# EAGLE design SoundLab (EAGLE 7.6.0)
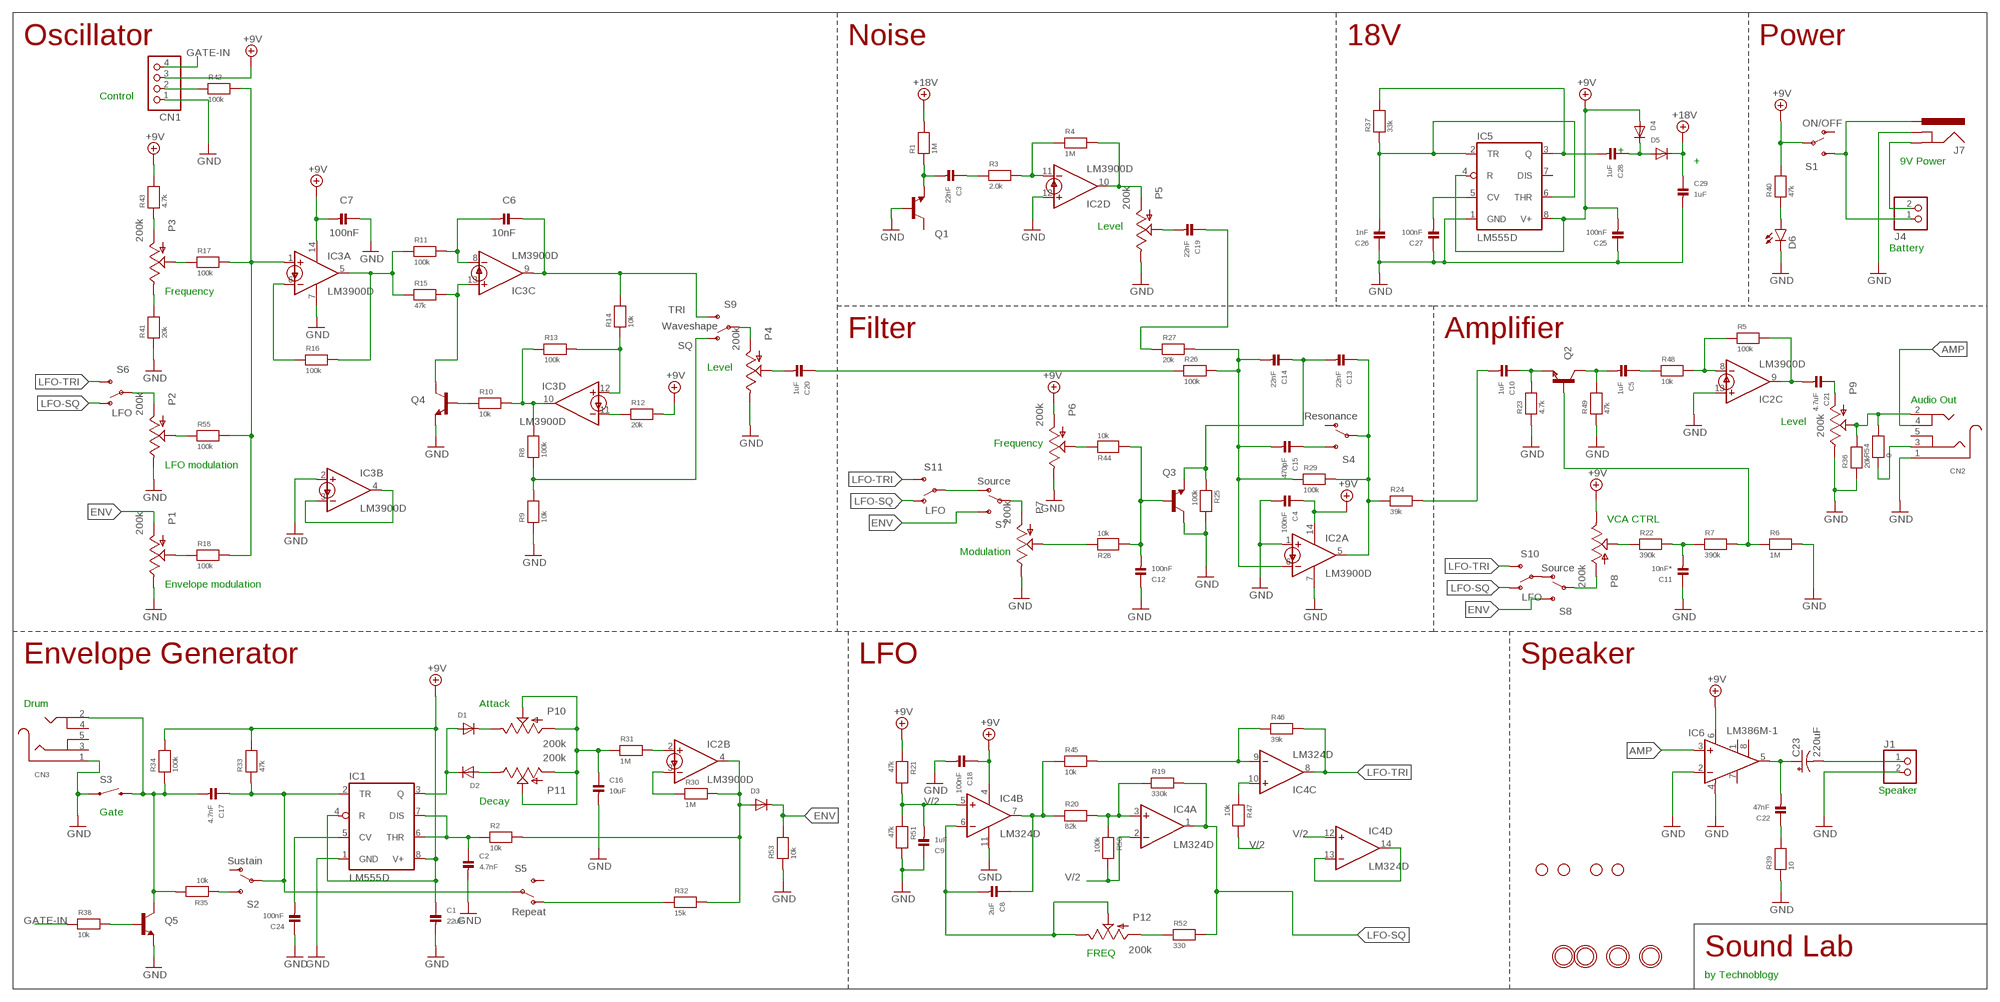
[diagram p0: schematic, sheet 1]

## Parts
C1  22uF  CAP_CERAMIC_0805MP  [_0805MP]
C2  4.7nF  CAP_CERAMIC_0805MP  [_0805MP]
C3  22nF  CAP_CERAMIC_0805MP  [_0805MP]
C4  100nF  CAP_CERAMIC_0805MP  [_0805MP]
C5  1uF  CAP_CERAMIC_0805MP  [_0805MP]
C6  10nF  CAP_CERAMIC_0805MP  [_0805MP]
C7  100nF  CAP_CERAMIC_0805MP  [_0805MP]
C8  2uF  CAP_CERAMIC_0805MP  [_0805MP]
C9  1uF  CAP_CERAMIC_0805MP  [_0805MP]
C10  1uF  CAP_CERAMIC_0805MP  [_0805MP]
C11  10nF*  CAP_CERAMIC_0805MP  [_0805MP]
C12  100nF  CAP_CERAMIC_0805MP  [_0805MP]
C13  22nF  CAP_CERAMIC_0805MP  [_0805MP]
C14  22nF  CAP_CERAMIC_0805MP  [_0805MP]
C15  470pF  CAP_CERAMIC_0805MP  [_0805MP]
C16  10uF  CAP_CERAMIC_0805MP  [_0805MP]
C17  4.7nF  CAP_CERAMIC_0805MP  [_0805MP]
C18  100nF  CAP_CERAMIC_0805MP  [_0805MP]
C19  22nF  CAP_CERAMIC_0805MP  [_0805MP]
C20  1uF  CAP_CERAMIC_0805MP  [_0805MP]
C21  4.7uF  CAP_CERAMIC_0805MP  [_0805MP]
C22  47nF  CAP_CERAMIC_0805MP  [_0805MP]
C23  220uF  47UF-50V-20%(ELECT)  [PANASONIC_D]
C24  100nF  CAP_CERAMIC_0805MP  [_0805MP]
C25  100nF  CAP_CERAMIC_0805MP  [_0805MP]
C26  1nF  CAP_CERAMIC_0805MP  [_0805MP]
C27  100nF  CAP_CERAMIC_0805MP  [_0805MP]
C28  1uF  CAP_CERAMIC_0805MP  [_0805MP]
C29  1uF  CAP_CERAMIC_0805MP  [_0805MP]
CN1  JST_4PIN  [JSTPH4]
CN2  AUDIO_3.5MMJACK  [4UCONN_19269]
CN3  AUDIO_3.5MMJACK  [4UCONN_19269]
D1  DIODESOD-123  [SOD-123]
D2  DIODESOD-123  [SOD-123]
D3  DIODESOD-123  [SOD-123]
D4  DIODESOD-123  [SOD-123]
D5  DIODESOD-123  [SOD-123]
D6  LED1206-BOTTOM  [LED-1206-BOTTOM]
IC1  LM555D  [SO08]
IC2  LM3900D  [SO14]
IC3  LM3900D  [SO14]
IC4  LM324D  [SO14]
IC5  LM555D  [SO08]
IC6  LM386M-1  [SO08]
J1  HEADER-1X2EDGE  [1X02_EDGESMT]
J4  HEADER-1X2EDGE  [1X02_EDGESMT]
J7  5.5x2.1mm Barrel  POWER_JACKSMD  [POWER_JACK_SMD]
JP1  STAND-OFF  [STAND-OFF]
JP2  STAND-OFF  [STAND-OFF]
JP3  STAND-OFF  [STAND-OFF]
JP4  STAND-OFF  [STAND-OFF]
P1  200k  POT  [ALPS_POT]
P2  200k  POT  [ALPS_POT]
P3  200k  POT  [ALPS_POT]
P4  200k  POT  [ALPS_POT]
P5  200k  POT  [ALPS_POT]
P6  200k  POT  [ALPS_POT]
P7  200k  POT  [ALPS_POT]
P8  200k  POT  [ALPS_POT]
P9  200k  POT  [ALPS_POT]
P10  200k  POT  [ALPS_POT]
P11  200k  POT  [ALPS_POT]
P12  200k  POT  [ALPS_POT]
Q1  MMBT3904  TRANSISTOR_NPNMMBT2222A  [SOT23-3]
Q2  MMBT3904  TRANSISTOR_NPNMMBT2222A  [SOT23-3]
Q3  MMBT3904  TRANSISTOR_NPNMMBT2222A  [SOT23-3]
Q4  MMBT3904  TRANSISTOR_NPNMMBT2222A  [SOT23-3]
Q5  MMBT3904  TRANSISTOR_NPNMMBT2222A  [SOT23-3]
R1  1M  RESISTOR_0805MP  [_0805MP]
R2  10k  RESISTOR_0805MP  [_0805MP]
R3  2.0k  RESISTOR_0805MP  [_0805MP]
R4  1M  RESISTOR_0805MP  [_0805MP]
R5  100k  RESISTOR_0805MP  [_0805MP]
R6  1M  RESISTOR_0805MP  [_0805MP]
R7  390k  RESISTOR_0805MP  [_0805MP]
R8  100k  RESISTOR_0805MP  [_0805MP]
R9  10k  RESISTOR_0805MP  [_0805MP]
R10  10k  RESISTOR_0805MP  [_0805MP]
R11  100k  RESISTOR_0805MP  [_0805MP]
R12  20k  RESISTOR_0805MP  [_0805MP]
R13  100k  RESISTOR_0805MP  [_0805MP]
R14  10k  RESISTOR_0805MP  [_0805MP]
R15  47k  RESISTOR_0805MP  [_0805MP]
R16  100k  RESISTOR_0805MP  [_0805MP]
R17  100k  RESISTOR_0805MP  [_0805MP]
R18  100k  RESISTOR_0805MP  [_0805MP]
R19  330k  RESISTOR_0805MP  [_0805MP]
R20  82k  RESISTOR_0805MP  [_0805MP]
R21  47k  RESISTOR_0805MP  [_0805MP]
R22  390k  RESISTOR_0805MP  [_0805MP]
R23  4.7k  RESISTOR_0805MP  [_0805MP]
R24  39k  RESISTOR_0805MP  [_0805MP]
R25  100k  RESISTOR_0805MP  [_0805MP]
R26  100k  RESISTOR_0805MP  [_0805MP]
R27  20k  RESISTOR_0805MP  [_0805MP]
R28  10k  RESISTOR_0805MP  [_0805MP]
R29  100k  RESISTOR_0805MP  [_0805MP]
R30  1M  RESISTOR_0805MP  [_0805MP]
R31  1M  RESISTOR_0805MP  [_0805MP]
R32  15k  RESISTOR_0805MP  [_0805MP]
R33  47k  RESISTOR_0805MP  [_0805MP]
R34  100k  RESISTOR_0805MP  [_0805MP]
R35  10k  RESISTOR_0805MP  [_0805MP]
R36  20k  RESISTOR_0805MP  [_0805MP]
R37  33k  RESISTOR_0805MP  [_0805MP]
R38  10k  RESISTOR_0805MP  [_0805MP]
R39  10  RESISTOR_0805MP  [_0805MP]
R40  47k  RESISTOR_0805MP  [_0805MP]
R41  20k  RESISTOR_0805MP  [_0805MP]
R42  100k  RESISTOR_0805MP  [_0805MP]
R43  4.7k  RESISTOR_0805MP  [_0805MP]
R44  10k  RESISTOR_0805MP  [_0805MP]
R45  10k  RESISTOR_0805MP  [_0805MP]
R46  39k  RESISTOR_0805MP  [_0805MP]
R47  10k  RESISTOR_0805MP  [_0805MP]
R48  10k  RESISTOR_0805MP  [_0805MP]
R49  47k  RESISTOR_0805MP  [_0805MP]
R50  100k  RESISTOR_0805MP  [_0805MP]
R51  47k  RESISTOR_0805MP  [_0805MP]
R52  330  RESISTOR_0805MP  [_0805MP]
R53  10k  RESISTOR_0805MP  [_0805MP]
R54  0  RESISTOR_0805MP  [_0805MP]
R55  100k  RESISTOR_0805MP  [_0805MP]
S1  ON/OFF  SWITCH-SPDTPTH  [SWITCH-SPDT]
S2  Sustain  SWITCH-SPDTPTH  [SWITCH-SPDT]
S3  SWITCH-MOMENTARY-212MM  [TACTILE-PTH-12MM]
S4  Resonance  SWITCH-SPDTPTH  [SWITCH-SPDT]
S5  Repeat  SWITCH-SPDTPTH  [SWITCH-SPDT]
S6  LFO  SWITCH-SPDTPTH  [SWITCH-SPDT]
S7  Source  SWITCH-SPDTPTH  [SWITCH-SPDT]
S8  Source  SWITCH-SPDTPTH  [SWITCH-SPDT]
S9  Waveshape  SWITCH-SPDTPTH  [SWITCH-SPDT]
S10  LFO  SWITCH-SPDTPTH  [SWITCH-SPDT]
S11  LFO  SWITCH-SPDTPTH  [SWITCH-SPDT]
U$2  MOUNTINGHOLE2.0  [MOUNTINGHOLE_2.0_PLATED]
U$3  MOUNTINGHOLE2.0  [MOUNTINGHOLE_2.0_PLATED]
U$6  MOUNTINGHOLE2.0  [MOUNTINGHOLE_2.0_PLATED]
U$7  MOUNTINGHOLE2.0  [MOUNTINGHOLE_2.0_PLATED]

## Nets
+9V: C1.1 C4.1 C7.2 C18.1 C25.2 CN1.3 D4.A IC1.4(R) IC1.8(V+) IC2.14(P:V+) IC3.14(P:V+) IC4.4(P:V+) IC5.4(R) IC5.8(V+) IC6.6(VS) P6.P$3(A) P8.P$1(E) R12.2 R21.1 R33.2 R34.2 R40.2 R43.2 S1.2(P)
+18V: C29.1 D5.C R1.2
AMP: CN2.4 IC6.3(+IN)
ENV: D3.C P1.P$3(A) R53.2 S7.3(S) S8.3(S)
ENV2: D3.A IC2.4(B:OUT) R2.2 R30.2 R32.2
GATE-IN: CN1.4 R38.1
GND: C1.2 C2.2 C4.2 C7.1 C9.1 C11.1 C12.1 C16.2 C18.2 C24.1 C25.1 C26.1 C27.1 C29.2 CN1.1 CN2.1 CN3.1 D6.C IC1.1(GND) IC2.1(A:+IN) IC2.7(P:GND) IC2.12(D:+IN) IC2.13(C:+IN) IC3.2(B:+IN) IC3.7(P:GND) IC4.11(P:V-) IC5.1(GND) IC6.2(-IN) IC6.4(GND) J1.2 J7.GND(GNDBREAK) P1.P$1(E) P2.P$1(E) P4.P$1(E) P5.P$1(E) P6.P$1(E) P7.P$1(E) P9.P$1(E) Q1.1(B) Q3.3(C) Q4.2(E) Q5.2(E) R6.2 R9.1 R23.1 R25.2 R36.1 R39.1 R41.1 R49.1 R51.2 R53.1 S3.1
LFO->VCA: S8.1(O) S10.2(P)
LFO->VCF: S7.1(O) S11.2(P)
LFO->VCO: P2.P$3(A) S6.2(P)
LFO-SQ: IC4.1(A:OUT) R19.2 R52.2 S6.1(O) S10.1(O) S11.1(O)
LFO-TRI: IC4.8(C:OUT) R46.2 S6.3(S) S10.3(S) S11.3(S)
N$1: IC3.1(A:+IN) R17.2 R18.2 R42.2 R55.2
N$2: IC3.6(A:-IN) R16.1
N$3: IC3.5(A:OUT) R11.1 R15.1 R16.2
N$4: IC3.13(C:+IN) Q4.3(C) R15.2
N$5: C6.2 IC3.8(C:-IN) R11.2
N$6: C8.1 IC4.7(B:OUT) R20.1 R45.1
N$7: Q4.1(B) R10.1
N$8: IC3.10(D:OUT) R8.2 R10.2 R13.1
N$9: R32.1 S5.1(O)
N$10: C17.1 IC1.2(TR) R33.1 S2.2(P) S5.2(P)
N$11: C19.1 R27.1
N$12: C21.2 IC2.9(C:OUT) R5.2
N$13: C2.1 IC1.6(THR) IC1.7(DIS) R2.1
N$14: P2.P$2(S) R55.1
N$15: IC4.3(A:+IN) R19.1 R20.2 R50.1
N$16: P7.P$2(S) R28.1
N$17: Q5.1(B) R38.2
N$18: CN2.3 R54.1
N$19: C16.1 P10.P$2(S) P10.P$3(A) P11.P$2(S) P11.P$3(A) R31.1
N$20: CN1.2 R42.1
N$21: D2.A P11.P$1(E)
N$22: D1.A D2.C IC1.3(Q)
N$23: P6.P$2(S) R44.1
N$24: IC3.11(D:-IN) R12.1
N$25: C10.2 R24.2
N$26: C5.2 Q2.3(C) R49.2
N$27: P3.P$3(A) R43.1
N$28: C10.1 Q2.2(E) R23.2
N$29: P3.P$1(E) R41.2
N$30: P3.P$2(S) R17.1
N$31: P1.P$2(S) R18.1
N$32: IC2.8(C:-IN) R5.1 R48.2
N$33: IC3.12(D:+IN) R13.2 R14.1
N$34: C8.2 IC4.6(B:-IN) P12.P$1(E) P12.P$2(S)
N$35: R35.1 S2.3(S)
N$36: C5.1 R48.1
N$37: IC4.13(D:-IN) IC4.14(D:OUT)
N$39: C23.- J1.1
N$41: P12.P$3(A) R52.1
N$42: IC2.2(B:+IN) R31.2
N$43: CN2.2 P9.P$2(S) R36.2 R54.2
N$44: IC4.9(C:-IN) R45.2 R46.1
N$45: J4.2 J7.P$4(GND)
N$46: P8.P$2(S) R22.1
N$47: IC4.10(C:+IN) R47.1
N$48: C3.1 R3.1
N$50: IC2.11(D:-IN) R3.2 R4.1
N$51: IC2.10(D:OUT) P5.P$3(A) R4.2
N$52: C3.2 Q1.2(E) R1.1
N$53: C20.2 P4.P$2(S)
N$54: C21.1 P9.P$3(A)
N$55: C19.2 P5.P$2(S)
N$57: C13.2 C14.1 Q3.2(E) R25.1
N$58: D1.C P10.P$1(E)
N$59: P7.P$3(A) S7.2(P)
N$60: C13.1 IC2.5(A:OUT) R24.1 R29.2 S4.2(P)
N$61: D6.A R40.1
N$64: C12.2 Q3.1(B) R28.2 R44.2
N$65: C15.1 S4.3(S)
N$66: C22.2 C23.+ IC6.5(OUT)
N$67: P8.P$3(A) S8.2(P)
N$68: C17.2 CN3.2 Q5.3(C) R34.1 R35.2 S3.3
N$69: C11.2 R7.1 R22.2
N$70: Q2.1(B) R6.1 R7.2
N$71: IC3.3(B:-IN) IC3.4(B:OUT)
N$72: C28.2 IC5.3(Q) R37.2
N$73: C26.2 IC5.2(TR) IC5.6(THR) R37.1
N$74: IC2.3(B:-IN) R30.1
N$75: C27.2 IC5.5(CV)
N$76: C28.1 D4.C D5.A
N$77: C24.2 IC1.5(CV)
N$78: C22.1 R39.2
N$79: J4.1 J7.VIN0(PWR) S1.3(S)
NOISE: C14.2 C15.2 IC2.6(A:-IN) R26.2 R27.2 R29.1
SQ: R8.1 R9.2 S9.1(O)
TRI: C6.1 IC3.9(C:OUT) R14.2 S9.3(S)
V/2: C9.2 IC4.2(A:-IN) IC4.5(B:+IN) IC4.12(D:+IN) R21.2 R47.2 R50.2 R51.1
WAVE: P4.P$3(A) S9.2(P)
WAVEFORM: C20.1 R26.1
Unconnected: CN2.5 CN3.3 CN3.4 CN3.5 IC5.7(DIS) IC6.1(GAIN) IC6.7(BYPASS) IC6.8(GAIN) Q1.3(C) S1.1(O) S2.1(O) S4.1(O) S5.3(S)

## Notes on the sheet
- Oscillator | Noise | 18V | Power
- Control
- +
- + | 9V Power
- Level
- Battery
- Frequency
- Filter | Amplifier
- Level
- Audio Out
- Level
- Frequency
- LFO modulation
- VCA CTRL
- Modulation
- Envelope modulation
- Envelope Generator | LFO | Speaker
- Drum | Attack
- Speaker
- Decay
- Gate
- FREQ | Sound Lab
- by Technoblogy

## Library data of the parts
C1-C22 C24-C29 = microbuilder:CAP_CERAMIC: Ceramic Capacitors 0402 - 0402 Surface Mount Capacitors 16pF 50V 5% [Digikey: 445-4899-2-ND] 18pF 50V 5% [Digikey: 490-1281-2-ND] 22pF 50V 5% [Digikey: 490-1283-2-ND] 68pF 50V 5% [Digikey: 490-1289-2-ND] 0.1uF 10V 10% [Digikey: 490-1318-2-ND] 1.0uF 6.3V 10% [Digikey: 490-1320-2-ND] 0603 - 0603 Surface Mount Capacitors 16 pF 50V 5% [Digikey: 445-5051-2-ND] 22 pF 50V [Digikey: PCC220ACVTR-ND] 33 pF 50V 5% [Digikey: 490-1415-1-ND] 56pF 50V 5% [Digikey: 490-1421-1-ND] 220pF 50V 5% [Digikey: 445-1285-1-ND] 680 pF 50V 2200 pF 50V 5% C0G [Digikey: 445-1297-1-ND] 5600 pF 100V 5% X7R [Digikey: 478-3711-1-ND] 0.1 µF 25V 10% [Digikey: PCC2277TR-ND] 0.22 µF 16V 10% X7R [Digikey: 445-1318-1-ND] 1.0 µF 25V 10% [Digikey: 445-5146-2-ND] 0603 - RF Specific 3pF 250V +/-0.1pF RF [Digikey: 712-1347-1-ND] 18 pF 250V 5% [Digikey: 478-3505-1-ND or 712-1322-1-ND] 56 pF 250V 5% C0G RF [Digikey: 490-4867-1-ND] 68 pF 250V RF [Digikey: 490-4868-1-ND] 0805 - 0805 Surface Mount Capacitors 220 pF 250V 2% RF Ceramic Capacitor [Digikey: 712-1398-1-ND] 1000 pF 50V 2% NP0 Ceramic Capacitor [Digikey: 478-3760-1-ND] 0.1 µF 25V 10% Ceramic Capacitor [Digikey: PCC1828TR-ND] 1.0 µF 16V 10% Ceramic Capacitor[Digikey: 490-1691-2-ND] 10.0 µF 10V 10% Ceramic Capacitor[Digikey: 709-1228-1-ND] 10.0 uF 16V 10% Ceramic Capacitor [Digikey: 478-5165-2-ND] 47 uF 6.3V 20% Ceramic Capacitor [Digikey: 587-1779-1-ND or 399-5506-1-ND] 1206 - 1206 Surface Mount Capacitors 47uF 10V 20% Ceramic Capacitor [Digikey: 490-5528-1-ND or 399-5508-1-ND or 445-6010-1-ND] 100uF 6.3V -20%, +80% Y5V Ceramic Capacitor (Digikey: 490-4512-1-ND, Mouser: 81-GRM31CF50J107ZE1L)
C23 = SparkFun-Capacitors:47UF-50V-20%(ELECT): CAP-10547; PROD_ID: CAP-10547
CN1 = microbuilder:JST_4PIN: JST 4-Pin Right-Angle Connector 4UConnector: 17312
CN2 CN3 = microbuilder:AUDIO_3.5MMJACK: 3.5MM Audio Jack These are normally connected as follows, from left-to right on the schematic symbol above: Tip: Left Audio Inner Ring: Right Audio Shell: Common/GND
D1-D5 = adafruit:DIODE: Diode SMADIODE - SMA Surface Mount Package 20V 1A Schottky Diode Digikey: 641-1014-6-ND DO-1N4148 - Through Hole Small Current Diode SOD-123 20V 1 A (.5mV Vf) Schottky Diode - Digikey: MBRX120TPMSCT-ND SOD-323 10V 570mA (.38mV Vf, 3ns) Schottky Diode - Digikey: ZLLS410CT-ND SOD-523 30V 30mA Schottky Diode (RB751S-40TE61) - Digikey: RB751S-40TE61CT-ND SOT23-R/W - SOT23 Package (R = Solder Paste/Reflow Ovens, W = Hand-Soldering) BAT54Film 40V 300mA - Digikey: 497-7162-1-ND
D6 = SparkFun-LED:LED: LEDs Standard schematic elements and footprints for 5mm, 3mm, 1206, and 0603 sized LEDs. 5mm - Spark Fun Electronics SKU : COM-00529 (and others)
IC1 IC5 = adafruit:*555: TIMER Changed DIP package to have round (not oval) pin pads http://www.ladyada.net/library/pcb/eaglelibrary.html
IC2 IC3 = linear:LM3900: OP AMP
IC4 = linear:LM324: OP AMP
IC6 = linear:LM386?-*: Low Voltage Audio Power Amplifier Source: http://cache.national.com/ds/LM/LM386.pdf
J1 J4 = microbuilder:HEADER-1X2: PIN HEADER
J7 = SparkFun-Connectors:POWER_JACK: Power Jack This is the standard 5.5mm barrel jack for power. The PTH is the most common, proven, reliable, footprint. The Slot footprint only works if the mill layer is transmitted to the PCB fab house so be warned. Mating wall wart : TOL-00298 (and others); PROD_ID: CONN-08106; SF_ID: PRT-12748
JP1-JP4 = SparkFun:STAND-OFF: Stand Off This is the mechanical footprint for a #4 phillips button head screw. Use the keepout ring to avoid running the screw head into surrounding components. SKU : PRT-00447
P1-P12 = SparkFun-Electromechanical:POT; PROD_ID: RES-09177
Q1-Q5 = technoblogy:TRANSISTOR_NPN: Generic NPN BJT MMBT2222A - TRANS-08049 (SOT-23, 1A 40V) MPSA42 - TRANS-09116 (SOT-23, 500mA 300V) MMBT5088LT1G - TRANS-11160 (SOT-23, 50 mA 30V) BC547 - COM-08928 <http://www.sparkfun.com/products/8928> (TO-92 45V 100mA) (1.Collector 2.Base 3.Emitter) 2N3904 - COM-00521 <http://www.sparkfun.com/products/521> (TO-92 40V 200mA) (1.Emitter 2.Base 3.Collector) P2N2222A - COM-12852 <http://www.sparkfun.com/products/12852> (TO-92 40V 600mA) (1.Collector 2.Base 3.Emitter); PROD_ID: TRANS-08049; VALUE: MMBT2222A
R1-R55 = microbuilder:RESISTOR: Resistors 0402 - 0402 Surface Mount Package 22 Ohm 1% 1/16W [Digikey: 311-22.0LRTR-ND] 33 Ohm 5% 1/16W 1.0K 5% 1/16W 1.5K 5% 1/16W 2.0K 1% 1/16W 10.0K 1% 1/16W [Digikey: 311-10.0KLRTR-ND] 10.0K 5% 1/16W [Digikey: RMCF0402JT10K0TR-ND] 12.1K 1% 1/16W [Digikey: 311-22.0LRTR-ND] 100.0K 5% 1/16W 0603 - 0603 Surface Mount Package 0 Ohm 1/10 Watt 1% Resistor 15 Ohm 1/10 Watt 1% Resistor 33 Ohm 1/10 Watt 1% Resistor 49.9 Ohm 1/10 Watt 1% Resistor 100 Ohm 1/10 Watt 1% Resistor 150 Ohm 1/10 Watt 1% Resistor 240 Ohm 1/10 Watt 1% Resistor 390 Ohm 1/10 Watt 1% Resistor 560 Ohm 1/10 Watt 1% Resistor 680 Ohm 1/10 Watt 1% Resistor 750 Ohm 1/10 Watt 1% Resistor 1.0K Ohm 1/10 Watt 1% Resistor 1.5K Ohm 1/10 Watt 1% Resistor 2.0K Ohm 1/10 Watt 1% Resistor 2.2K Ohm 1/10 Watt 1% Resistor 3.3K Ohm 1/10 Watt 1% Resistor 4.7K Ohm 1/10 Watt 1% Resistor 10.0K Ohm 1/10 Watt 1% Resistor 12.0K Ohm 1/10 Watt 1% Resistor 12.1K Ohm 1/10 Watt 1% Resistor 20.0K Ohm 1/10 Watt 1% Resistor 33.0K Ohm 1/10 Watt 1% Resistor 100.0K Ohm 1/10 Watt 1% Resistor 0805 - 0805 Surface Mount Package 0 Ohm 1/8 Watt 1% Resistor 33 Ohm 1/8 Watt 1% Resistor 100 Ohm 1/8 Watt 1% Resistor 150 Ohm 1/8 Watt 1% Resistor 200 Ohm 1/8 Watt 1% Resistor 240 Ohm 1/8 Watt 1% Resistor 330 Ohm 1/8 Watt 1% Resistor 390 Ohm 1/8 Watt 1% Resistor 470 Ohm 1/8 Watt 1% Resistor 1.0K Ohm 1/8 Watt 1% Resistor 1.5K Ohm 1/8 Watt 1% Resistor 2.0K Ohm 1/8 Watt 1% Resistor 4.7K Ohm 1/8 Watt 1% Resistor 5.1K Ohm 1/8 Watt 1% Resistor 5.6K Ohm 1/8 Watt 1% Resistor 10.0K Ohm 1/8 Watt 1% Resistor 22.0K Ohm 1/8 Watt 1% Resistor 33.0K Ohm 1/8 Watt 1% Resistor 100K Ohm 1/8 Watt 1% Resistor 1206 - 1206 Surface Mount Package 2012 - 2010 Surface Mount Package 0.11 Ohm 1/2 Watt 1% Resistor - Digikey: RHM.11UCT-ND
S1 S2 S4-S11 = technoblogy:SWITCH-SPDT: SPDT Switch Simple slide switch, Spark Fun Electronics SKU : COM-00102 DPDT SMT slide switch, AYZ0202, SWCH-08179; PROD_ID: SWCH-08261
S3 = SparkFun-Electromechanical:SWITCH-MOMENTARY-2: Various NO switches- pushbuttons, reed, etc; PROD_ID: SWCH-09185
U$2 U$3 U$6 U$7 = microbuilder:MOUNTINGHOLE: Mounting Hole For #2 screws (0.086"/2.18mm width, 0.094"/2.4mm hole) use 2.5mm

## Board
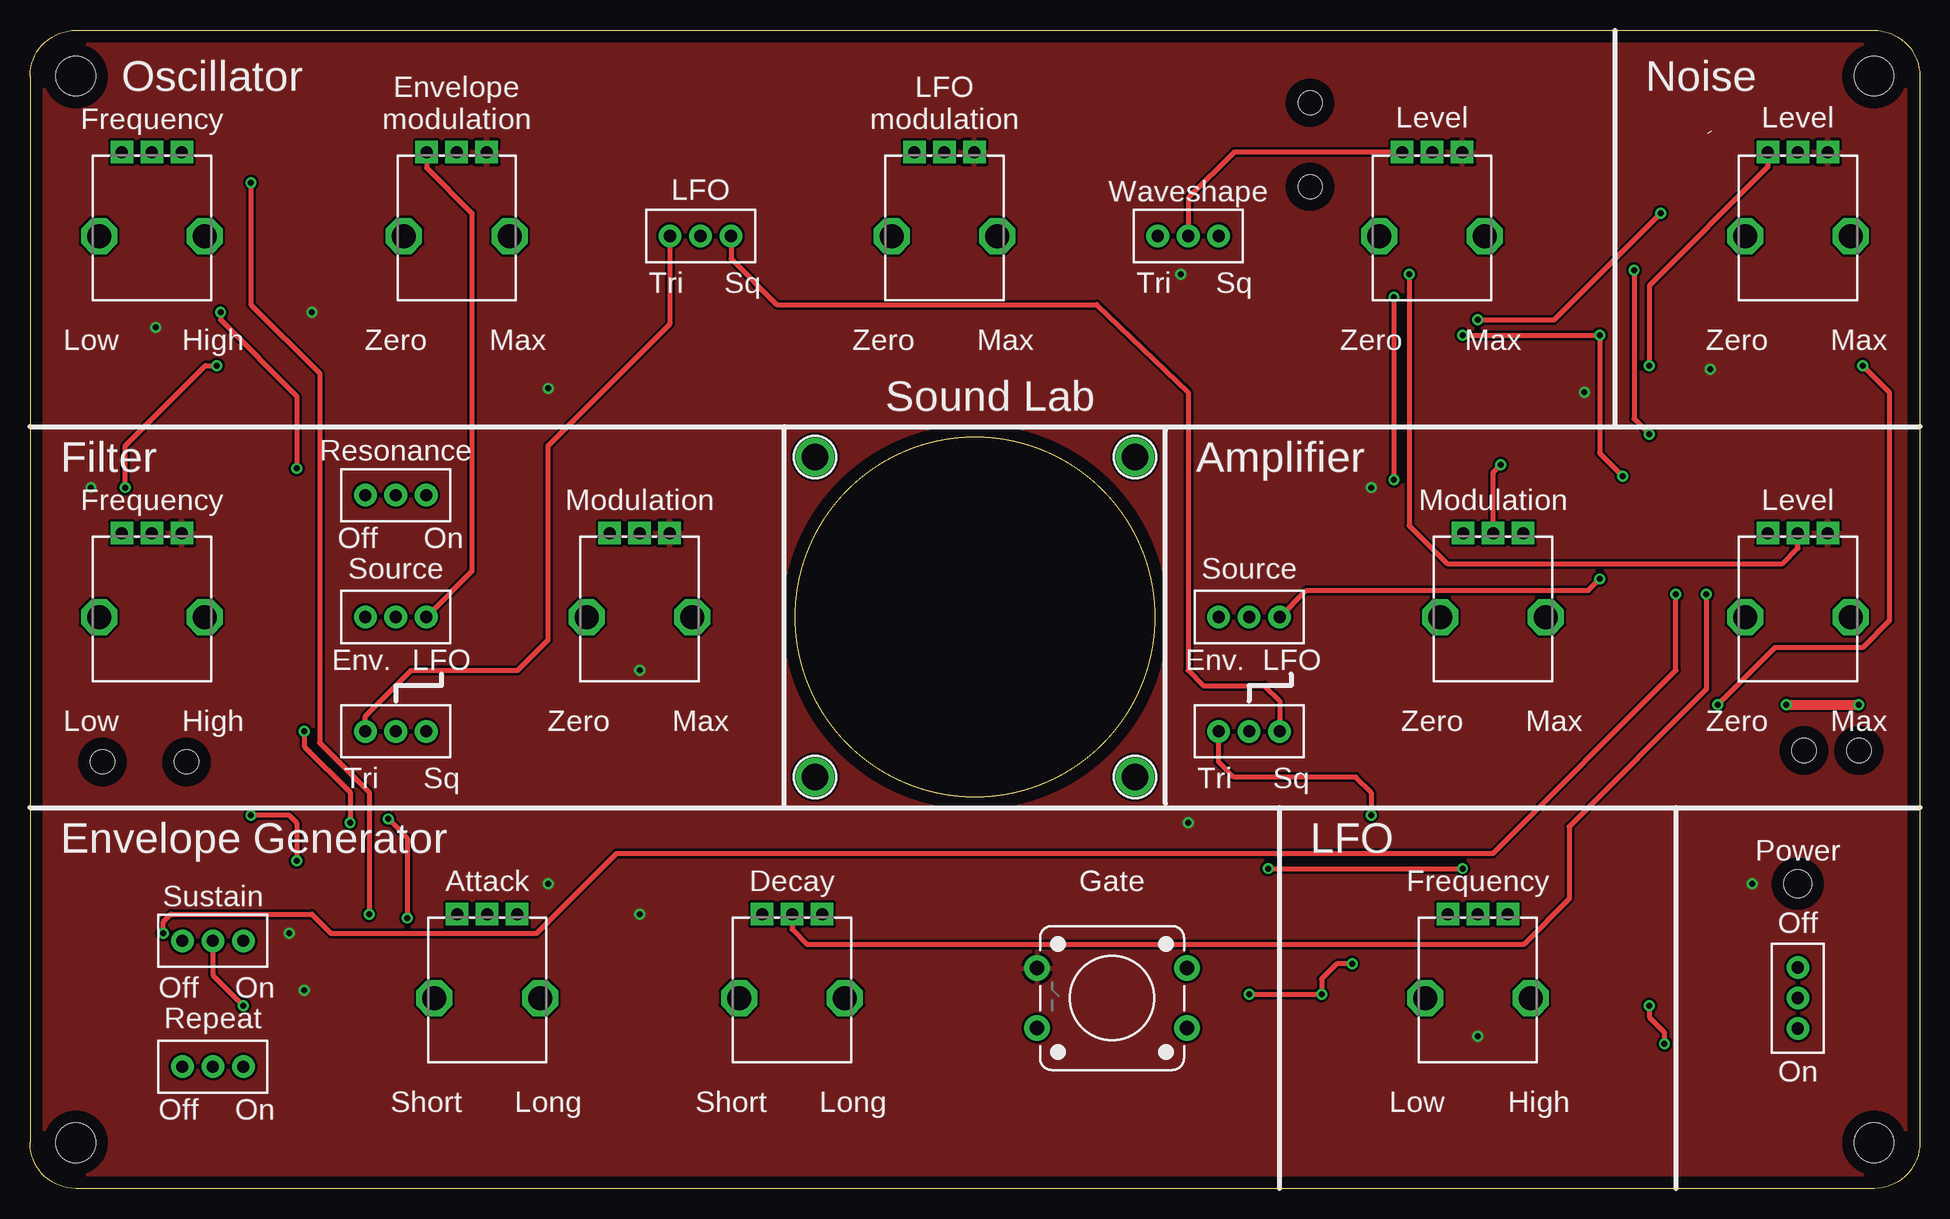
[diagram p1: board, top side]
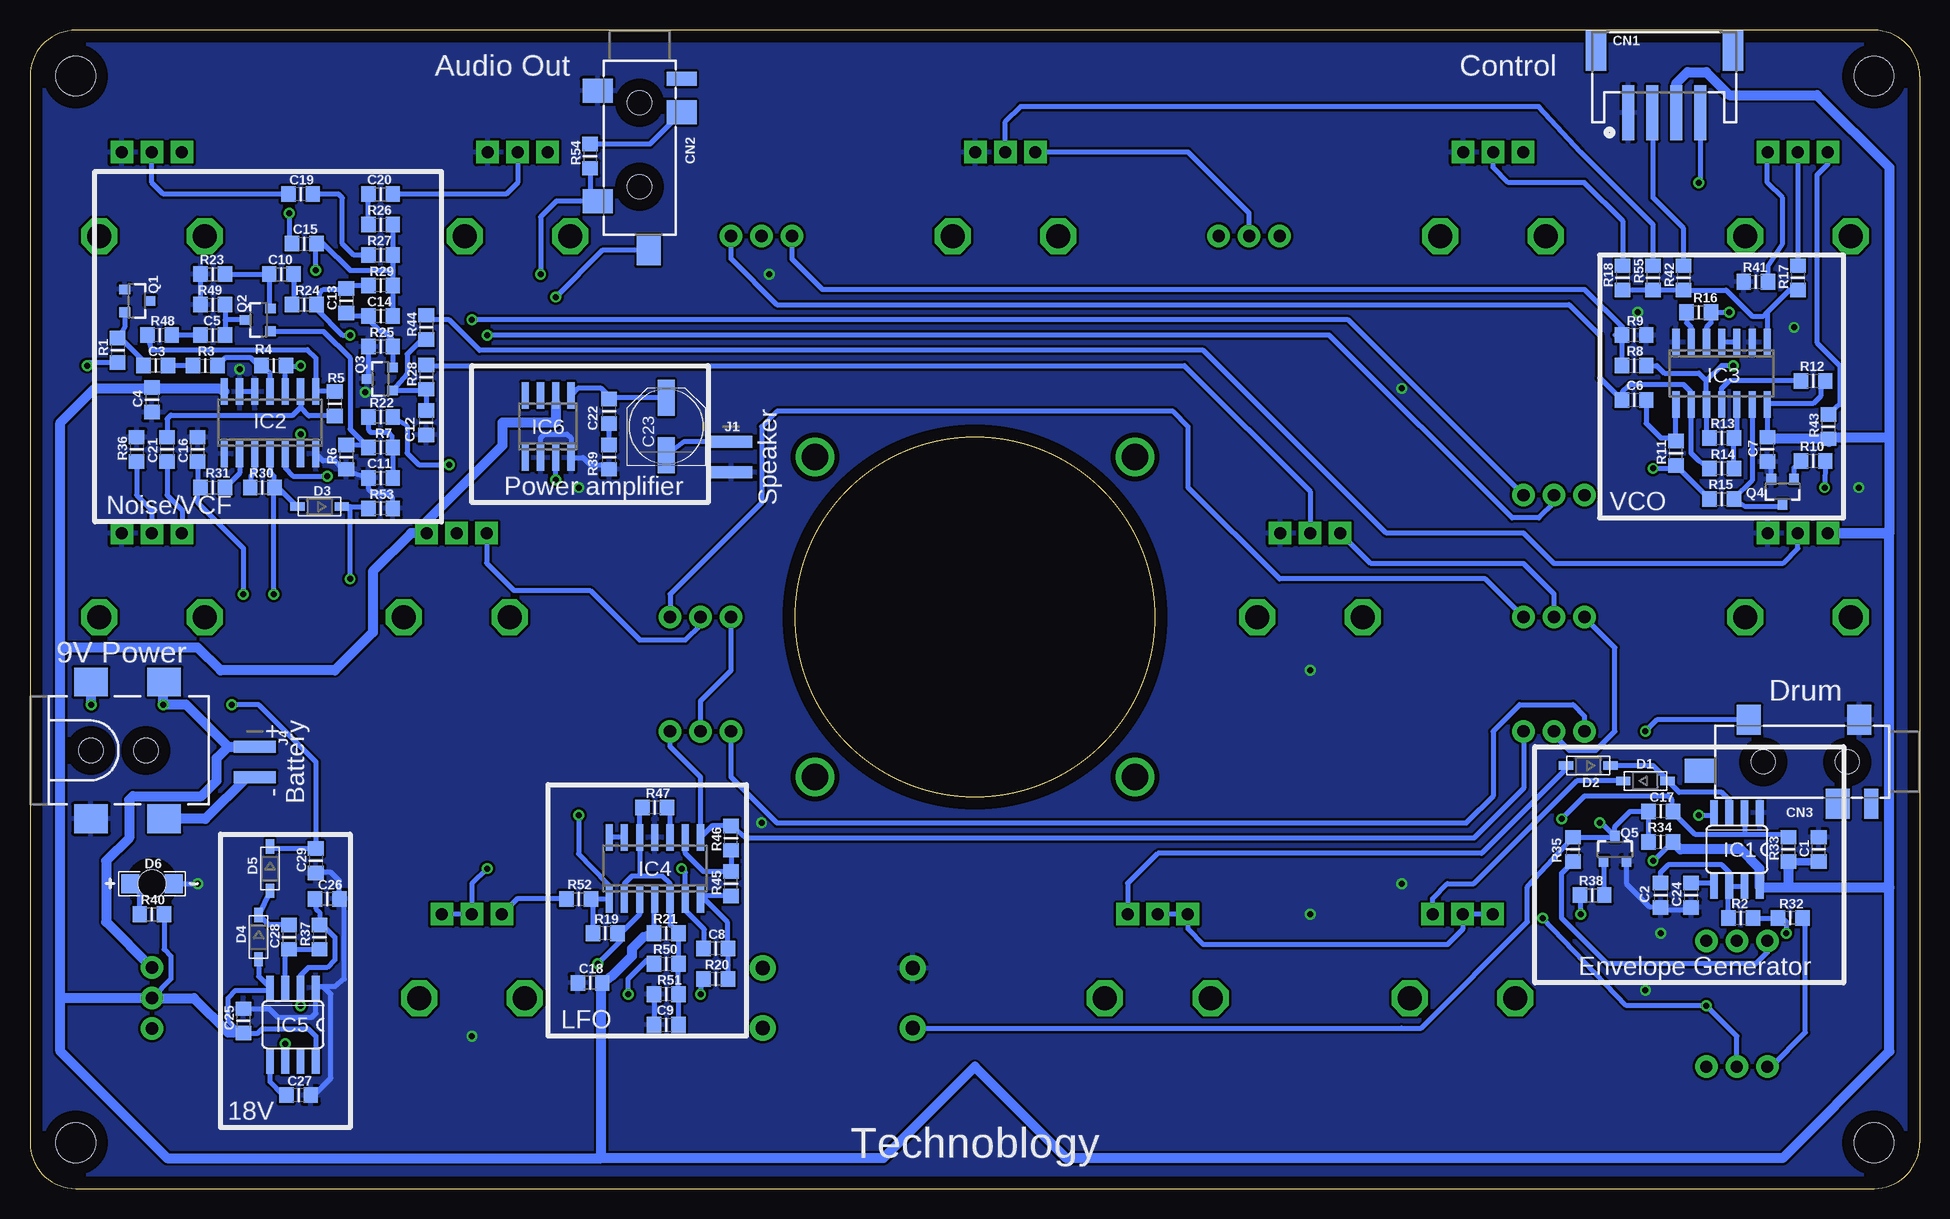
[diagram p2: board, bottom side, seen from below]

Size 157.48 x 96.52 mm. Coordinates in mm from the lower left corner, seen from the top.
Outline: 0,92.71 arc-90 3.81,96.52 153.67,96.52 arc-90 157.48,92.71 157.48,3.81 arc-90 153.67,0 3.81,0 arc-90 0,3.81 0,92.71
Outline: circle at 78.74,47.62 radius 14.99
Copper layers (1*16): Top 0.035mm / dielectric 1.5mm / Bottom 0.035mm
Design rules "default *": minimum track width 10mil, minimum drill 24mil, track to track 8mil, track to pad 8mil, pad to pad 8mil, via to via 8mil, smd to smd 8mil, copper to edge 40mil, drill to drill 8mil, minimum pad ring 10mil, minimum via ring 8mil, stop-mask expansion 4mil, vias tented up to drill 20mil, thermal gap 10mil

### Footprints (pad centres in the part's own frame; a part is rotated, then mirrored left to right if it is on the bottom)
_0805MP = smd 1.2 x 1.3: 1 -1.016,0; 2 1.016,0
PANASONIC_D = smd 3 x 1.4: + 2.4,0; - -2.4,0
JSTPH4 = smd 1 x 4.6: 1 -3,-3.7; 2 -1,-3.7; 3 1,-3.7; 4 3,-3.7 | smd 1.7 x 3.4: NC1 -5.7,1.5; NC2 5.7,1.5
4UCONN_19269 = smd 2 x 2.5: 1 2.5,-3.5; 2 11.7,-3.5; 3 4.3,3.5 | smd 2.5 x 2: 4 15.8,0.75 | smd 1.2 x 2.5: 5 1.5,3.5 | hole 2: 3.5,0; 10.5,0
SOD-123 = smd 1.2 x 0.7: A 1.85,0; C -1.85,0
LED-1206-BOTTOM = smd 1.5 x 1.6: A -1.8,0; C 1.8,0 | hole 2.3: 0,0
SO08 = smd 0.66 x 2.032: 1 -1.905,-3.073; 2 -0.635,-3.073; 3 0.635,-3.073; 4 1.905,-3.073; 5 1.905,3.073; 6 0.635,3.073; 7 -0.635,3.073; 8 -1.905,3.073
SO14 = smd 0.6 x 2.2: 1 -3.81,-2.6; 2 -2.54,-2.6; 3 -1.27,-2.6; 4 0,-2.6; 5 1.27,-2.6; 6 2.54,-2.6; 7 3.81,-2.6; 8 3.81,2.6; 9 2.54,2.6; 10 1.27,2.6; 11 0,2.6; 12 -1.27,2.6; 13 -2.54,2.6; 14 -3.81,2.6
SO08' = smd 0.6 x 2.2: 1 -1.905,-2.6; 2 -0.635,-2.6; 3 0.635,-2.6; 4 1.905,-2.6; 5 1.905,2.6; 6 0.635,2.6; 7 -0.635,2.6; 8 -1.905,2.6
1X02_EDGESMT = smd 1 x 3.5: 1 -1.27,0; 2 1.27,0
POWER_JACK_SMD = smd 2.8 x 2.4: GND 0,-5.7; P$4 6.1,-5.7; VIN0 0,5.7; VIN1 6.1,5.7 | hole 2.032: 0,0; 4.572,0
STAND-OFF = hole 3.302: 0,0
ALPS_POT = drill 1 pad 1.88 square: P$1 7,-2.5; P$2 7,0; P$3 7,2.5 | drill 2 octagon: P$4 0,-4.4; P$5 0,4.4
SOT23-3 = smd 0.8 x 0.9: 1 -0.95,-1; 2 0.95,-1; 3 0,1.1
SWITCH-SPDT = drill 1.016 pad 1.88: 1 0,2.54; 2 0,0; 3 0,-2.54
TACTILE-PTH-12MM = drill 1.2 pad 2.159: 1 6.25,-2.5; 2 -6.25,-2.5; 3 6.25,2.5; 4 -6.25,2.5
MOUNTINGHOLE_2.0_PLATED = drill 2.2 pad 3: P$1 0,0

### Placement (x,y rotation side)
C1  8.41,28.26 90 bottom
C2  21.59,24.45 270 bottom
C3  147,68.58 180 bottom
C4  147.32,65.72 270 bottom
C5  142.24,71.12 0 bottom
C6  23.81,65.72 0 bottom
C7  12.7,61.59 90 bottom
C8  100.33,20 180 bottom
C9  104.46,13.65 0 bottom
C10  136.53,76.2 0 bottom
C11  128.27,59.21 0 bottom
C12  124.46,63.82 90 bottom
C13  131.13,73.98 270 bottom
C14  128.27,72.71 0 bottom
C15  134.62,78.74 0 bottom
C16  143.51,61.59 90 bottom
C17  21.59,31.43 180 bottom
C18  110.81,17.14 180 bottom
C19  134.94,82.87 180 bottom
C20  128.27,82.87 0 bottom
C21  146.05,61.59 90 bottom
C22  109.22,64.77 90 bottom
C23  104.46,63.5 90 bottom
C24  19.05,24.45 90 bottom
C25  139.7,13.97 270 bottom
C26  132.72,24.13 180 bottom
C27  135.1,7.78 180 bottom
C28  135.89,20.95 270 bottom
C29  133.67,27.3 270 bottom
CN1  21.27,93.34 0 bottom
CN2  106.68,93.98 270 bottom
CN3  2.54,35.56 180 bottom
D1  22.86,33.97 0 bottom
D2  27.62,35.24 180 bottom
D3  133.35,56.83 180 bottom
D4  138.43,20.95 270 bottom
D5  137.48,26.67 270 bottom
D6  147.32,25.4 0 bottom
IC1  15.24,28.26 180 bottom
IC2  137.48,63.82 0 bottom
IC3  16.51,67.94 180 bottom
IC4  105.41,26.67 0 bottom
IC5  135.57,13.65 180 bottom
IC6  LM386M-1  [SO08']  114.3,63.5 0 bottom
J1  99.06,60.96 270 bottom
J4  138.75,35.56 270 bottom
J7  152.4,36.51 0 bottom
JP1  3.81,92.71 0 top
JP2  153.67,92.71 0 top
JP3  3.81,3.81 0 top
JP4  153.67,3.81 0 top
P1  35.56,79.38 90 top
P2  76.2,79.38 90 top
P3  10.16,79.38 90 top
P4  116.84,79.38 90 top
P5  147.32,79.38 90 top
P6  10.16,47.62 90 top
P7  50.8,47.62 90 top
P8  121.92,47.62 90 top
P9  147.32,47.62 90 top
P10  38.1,15.88 90 top
P11  63.5,15.88 90 top
P12  120.65,15.88 90 top
Q1  148.59,73.98 270 bottom
Q2  138.43,72.39 90 bottom
Q3  128.27,67.47 90 bottom
Q4  11.43,58.1 180 bottom
Q5  25.4,28.26 0 bottom
R1  150.18,69.85 270 bottom
R2  14.92,22.54 0 bottom
R3  142.88,68.58 0 bottom
R4  137.16,68.58 0 bottom
R5  132.08,65.41 270 bottom
R6  131.13,60.96 270 bottom
R7  128.27,61.75 180 bottom
R8  23.81,68.58 0 bottom
R9  23.81,71.12 180 bottom
R10  8.89,60.64 0 bottom
R11  20.32,61.28 90 bottom
R12  8.89,67.31 0 bottom
R13  16.51,62.55 0 bottom
R14  16.51,60.01 180 bottom
R15  16.51,57.47 0 bottom
R16  18.41,73.03 0 bottom
R17  10.16,75.88 270 bottom
R18  24.77,75.88 270 bottom
R19  109.54,21.27 180 bottom
R20  100.33,17.46 180 bottom
R21  104.46,21.27 0 bottom
R22  128.27,64.29 180 bottom
R23  142.24,76.2 0 bottom
R24  134.62,73.66 180 bottom
R25  128.27,70.17 180 bottom
R26  128.27,80.33 0 bottom
R27  128.27,77.79 0 bottom
R28  124.46,67.63 270 bottom
R29  128.27,75.25 180 bottom
R30  138.11,58.42 0 bottom
R31  142.24,58.42 0 bottom
R32  10.79,22.54 180 bottom
R33  10.95,28.26 270 bottom
R34  21.59,28.89 0 bottom
R35  28.89,28.26 90 bottom
R36  148.59,61.59 270 bottom
R37  133.35,20.95 270 bottom
R38  27.3,24.45 0 bottom
R39  109.22,60.96 90 bottom
R40  147.32,22.86 0 bottom
R41  13.65,75.56 0 bottom
R42  19.68,75.88 270 bottom
R43  7.62,63.5 270 bottom
R44  124.46,71.75 270 bottom
R45  99.06,25.4 90 bottom
R46  99.06,29.21 90 bottom
R47  105.41,31.75 180 bottom
R48  146.69,71.12 180 bottom
R49  142.24,73.66 0 bottom
R50  104.46,18.73 0 bottom
R51  104.46,16.19 180 bottom
R52  111.76,24.13 0 bottom
R53  128.27,56.67 180 bottom
R54  110.81,86.04 270 bottom
R55  22.23,75.88 270 bottom
S1  147.32,15.88 180 top
S2  15.24,20.64 270 top
S3  90.17,15.88 180 top
S4  30.48,57.78 90 top
S5  15.24,10.16 90 top
S6  55.88,79.38 90 top
S7  30.48,47.62 90 top
S8  101.6,47.62 90 top
S9  96.52,79.38 90 top
S10  101.6,38.1 90 top
S11  30.48,38.1 90 top
U$2  65.41,60.96 0 top
U$3  92.08,60.96 0 top
U$6  65.41,34.29 0 top
U$7  92.08,34.29 0 top

### Tracks (layer width: path | path; a pad name or v marks a point on that pad's centre or on a via)
+9V  (via drill 0.5)
  Top 0.406: v22.23,27.3 22.23,30.48 21.59,31.11 v18.41,31.11
  Bottom 0.406: R12.2 8.26,66.93 8.26,66.04 8.89,65.41 12.64,65.41 IC3.14 C7.2 12.7,62.55 | R21.1 105.47,24.01 IC4.4 | IC5.8 133.67,12.7 134.3,13.34 138.11,13.34 138.49,12.95 C25.2 139.95,12.95 140.97,13.97 140.97,15.88 140.34,16.51 137.69,16.51 IC5.4 138.43,17.68 D4.A | v22.23,27.3 22.16,27.3 R34.2 | v18.41,31.11 17.25,31.11 IC1.4 | IC6.6 113.67,65.41 | 146.69,15.88 S1.2 145.73,17.46 145.73,19.37 146.3,19.94 R40.2
  Bottom 0.61: C1.1 R33.2
  Bottom 0.813: 139.7,13.16 C25.2 | 154.94,15.88 154.94,11.43 146.05,2.54 109.86,2.54 | 154.94,15.88 154.94,45.09 | 154.94,45.09 154.94,63.82 152.08,66.67 147.38,66.67 C4.1 147.26,66.67 141.54,66.67 IC2.14 | 109.86,2.54 109.86,17.08 C18.1 108.9,17.78 107.31,19.37 107.31,20 106.36,20.95 R21.1 | 7.56,62.23 R43.2 | 154.94,45.09 143.51,45.09 141.6,43.18 132.08,43.18 128.91,46.35 128.91,51.44 125.72,54.62 P8.P$1 124.46,54.66 124.46,55.56 118.11,61.91 118.11,63.82 113.67,63.82 113.67,65.41 | 2.54,54.61 2.56,54.62 P6.P$3 7.64,54.61 2.54,54.61 | 139.9,13.16 C25.2 | 2.54,25.08 2.54,11.43 11.43,2.54 71.12,2.54 78.74,10.16 86.36,2.54 109.86,2.54 | 2.54,25.08 2.54,54.61 | CN1.3 20.27,92.12 19.37,93.03 17.78,93.03 15.88,91.12 8.57,91.12 2.54,85.09 2.54,62.55 | 2.54,62.55 2.54,54.61 | 12.64,62.55 C7.2 12.7,62.48 R43.2 | 2.54,25.08 10.95,25.08 | 10.95,25.08 13.23,25.08 IC1.8 13.34,26.67 14.92,28.26 19.94,28.26 R34.2 | R33.2 10.95,25.08 | 2.54,62.55 7.62,62.55 R43.2 | 154.94,15.88 S1.2 143.83,15.88 140.97,13.02 139.76,13.02 C25.2
+18V  (via drill 0.5)
  Top 0.406: v152.72,68.58 154.94,66.36 154.94,47.31 152.72,45.09 145.41,45.09 v140.65,40.32
  Bottom 0.406: 133.78,28.2 C29.1 | C29.1 137.28,28.32 D5.C | R1.2 152.46,68.83 v152.72,68.58 | C29.1 133.67,35.56 138.43,40.32 v140.65,40.32
AMP  (via drill 0.5)
  Top 0.406: v113.67,74.3 v113.67,59.05
  Bottom 0.406: v113.67,59.05 IC6.3 | CN2.4 109.78,78.18 v113.67,74.3
ENV  (via drill 0.5)
  Top 0.406: S8.3 106.36,49.85 129.86,49.85 v130.81,50.8 | P1.P$3 33.06,85.05 36.83,81.28 36.83,51.44 S7.3
  Bottom 0.406: 130.81,56.83 D3.C | v130.81,50.8 130.81,56.83 | 130.81,56.83 129.44,56.83 R53.2 | S8.3 104.14,49.53 96.52,57.15 96.52,63.5 95.25,64.77 62.23,64.77 60.96,63.5 60.96,58.42 53.34,50.8 36.2,50.8 S7.3
ENV2  (via drill 0.5)
  Top 0.406: v137.16,49.53 137.16,43.18 121.92,27.94 48.9,27.94 42.23,21.27 25.08,21.27 23.5,22.86 11.75,22.86 11.11,22.23 v11.11,21.27
  Bottom 0.406: R2.2 R32.2 11.75,22.61 11.75,22.86 11.11,22.23 v11.11,21.27 | v137.16,49.53 137.16,58.36 R30.2 | IC2.4 137.48,59.69 137.16,59.37 137.16,58.48 R30.2 | R30.2 136.79,58.42 D3.A
GATE-IN  (via drill 0.5)
  Top 0.406: v28.26,22.86 28.26,33.02 24.13,37.15 24.13,67.94 18.41,73.66 v18.41,83.82
  Bottom 0.406: v28.26,22.86 28.26,24.38 R38.1 | CN1.4 18.27,83.96 v18.41,83.82
GND  (via drill 0.5)
  Bottom 0.406: R39.1 109.6,60.33 110.81,60.33 111.38,60.9 IC6.4 112.39,62.55 112.71,62.87 114.62,62.87 114.94,62.55 IC6.2 | IC2.12 IC2.13 | 12.64,60.58 C7.1 12.38,60.26 12.38,59.37 | C27.1 133.83,7.78 132.4,9.21 132.4,16.19 133.03,16.83 | 133.03,16.83 133.57,16.83 IC5.1 133.67,14.61 133.99,14.29 136.84,14.29 137.54,14.99 C25.1 | 133.03,16.83 132.08,16.83 131.29,17.46 131.29,23.88 C26.1 131.7,25.65 132.4,26.35 133.6,26.35 C29.2 | R51.2 C9.1 | 143.19,73.72 R49.1 | 143.51,73.91 R49.1 | R49.1 R23.1 | C24.1 19.17,23.55 19.17,23.29 19.05,23.18 21.34,23.18 C2.2 21.64,23.5 22.54,23.5 24.45,25.4 Q5.2 | IC2.7 133.09,60.64 132.08,60.64 131.38,59.94 R6.2 130.87,59.69 C11.1 129.29,58.33 128.91,57.94 127.64,57.94 127.25,57.56 R53.1 | R25.2 129.29,67.55 Q3.3 | D6.C v143.51,25.4
  other vias: 140.02,68.26 50.8,22.86 43.18,25.4 22.86,16.51 129.54,66.36 10.48,71.75 5.08,58.42 111.76,58.42 23.5,73.03 21.59,21.27 120.65,12.7 43.18,66.67 96.52,30.48 95.89,76.2 50.8,43.18
  pour Bottom: 0,96.52 157.48,96.52 157.48,0 0,0
  pour Top: 0,96.52 157.48,96.52 157.48,0 0,0
LFO->VCA
  Bottom 0.406: S10.2 101.6,40.64 99.06,43.18 S8.1
LFO->VCF
  Bottom 0.406: S11.2 30.48,37.78 29.21,36.51 26.99,36.51 25.4,38.1 25.4,45.09 S7.1
LFO->VCO
  Bottom 0.406: S6.2 55.88,81.28 60.96,86.36 73.69,86.36 P2.P$3
LFO-SQ  (via drill 0.5)
  Top 0.406: S11.1 27.94,39.37 31.75,43.18 40.64,43.18 43.18,45.72 43.18,61.91 53.34,72.07 S6.1 | v111.76,31.11 111.76,33.02 110.49,34.29 100.33,34.29 99.06,35.56 S10.1
  Bottom 0.406: R19.2 110.55,23.94 R52.2 109.28,24.13 IC4.1 109.28,25.34 111.78,27.92 111.76,27.94 v111.76,31.11 | S10.1 99.06,34.29 95.25,30.48 37.78,30.48 35.56,32.7 35.56,38.1 33.34,40.32 28.89,40.32 27.94,39.37 S11.1
LFO-TRI
  Top 0.406: S10.3 104.14,40.64 102.87,41.91 97.79,41.91 96.52,43.18 96.52,66.36 88.9,73.66 62.23,73.66 58.42,77.47 S6.3
  Bottom 0.406: S11.3 33.02,33.34 37.15,29.21 97.85,29.21 R46.2 100.64,30.23 IC4.8 101.6,34.29 104.14,36.83 S10.3
N$1
  Bottom 0.406: 12.64,70.48 IC3.1 12.7,73.03 | R18.2 R55.2 R42.2 16.13,74.87 13.97,72.71 13.02,72.71 12.7,73.03 | R17.2 10.86,74.87 12.7,73.03
N$2
  Bottom 0.406: R16.1 19.43,72.14 19.05,71.75 IC3.6
N$3  (via drill 0.5)
  Top 0.406: v15.88,73.03 15.88,72.39 22.23,66.04 v22.23,60.01
  Bottom 0.406: R15.1 R11.1 20.57,60.01 v22.23,60.01 | v15.88,73.03 R16.2 17.4,72.14 17.78,71.75 IC3.5
N$4
  Bottom 0.406: IC3.13 13.97,58.99 R15.2 14.54,56.83 11.75,56.83 Q4.3
N$5
  Bottom 0.406: IC3.8 R11.2 20.57,62.55 21.59,62.55 22.8,63.75 C6.2
N$6
  Bottom 0.406: 101.54,24.13 IC4.7 | R20.1 C8.1 99.38,20.07 99.38,22.23 101.22,24.07 IC4.7 | R45.1 101.29,24.38 IC4.7
N$7
  Bottom 0: R10.1 10.16,60.64 10.16,60.96
  Bottom 0.406: Q4.1 10.48,60.07 R10.1
N$8  (via drill 0.5)
  Top 0.406: v7.94,58.42 7.94,61.91 14.61,68.58 v15.56,68.58
  Bottom 0.406: R13.1 17.78,62.17 IC3.10 17.78,67.31 | R8.2 21.91,68.58 21.27,67.94 18.41,67.94 17.78,67.31 | 17.78,67.31 16.51,68.58 v15.56,68.58 | R10.2 v7.94,58.42
N$9
  Bottom 0.406: S5.1 12.38,10.16 9.53,13.02 9.53,22.29 R32.1
N$10  (via drill 0.5)
  Top 0.406: v29.84,30.8 31.43,29.21 v31.43,22.54 | v17.78,15.24 15.24,17.78 S2.2
  Bottom 0.406: 14.61,29.53 18.73,29.53 20.57,31.37 C17.1 20.64,31.5 20.64,32.38 20.95,32.7 27.94,32.7 v29.84,30.8 | 14.61,29.53 11.49,29.53 R33.1 | IC1.2 14.61,29.53 | v31.43,22.54 24.45,15.24 v17.78,15.24 15.24,12.7 S5.2
N$11
  Bottom 0.406: R27.1 130.49,77.79 131.44,78.74 131.44,82.55 131.76,82.87 C19.1
N$12
  Bottom 0.406: 134.94,65.09 135.57,64.45 145.73,64.45 146.05,64.14 C21.2 | R5.2 134.24,64.39 134.94,65.09 | IC2.9 134.94,65.09
N$13
  Bottom 0.406: IC1.6 15.88,26.35 16.51,26.99 20.95,26.99 21.59,26.35 C2.1 | IC1.6 IC1.7 | R2.1 15.94,25.12 IC1.6
N$14
  Bottom 0.406: R55.1 22.23,80.33 28.26,86.36 31.75,90.17 74.93,90.17 76.2,88.9 P2.P$2
N$15  (via drill 0.5)
  Top 0.406: v101.6,16.19 v107.63,16.19 107.63,17.46 108.9,18.73 v110.17,18.73
  Bottom 0.406: R20.2 101.6,17.46 v101.6,16.19 | IC4.3 106.68,22.86 108.27,21.27 | v107.63,16.19 107.63,17.46 106.05,19.05 R50.1 | 108.27,21.27 R19.1 | 108.27,21.27 108.27,20.64 v110.17,18.73
N$16
  Bottom 0.406: R28.1 124.46,68.58 61.28,68.58 50.8,58.1 P7.P$2
N$17
  Bottom 0.406: Q5.1 26.35,24.51 R38.2
N$18
  Bottom 0.406: R54.1 105.8,87.06 CN2.3
N$19  (via drill 0.5)
  Top 0.406: P11.P$2 63.5,21.59 64.77,20.32 124.46,20.32 128.27,24.13 128.27,30.16 139.7,41.59 v139.7,49.53
  Bottom 0.406: R31.1 143.26,58.17 | C16.1 143.51,58.67 R31.1 | R31.1 143.51,58.17 143.51,57.15 139.7,53.34 v139.7,49.53 | P10.P$3 P10.P$2 38.1,21.59 39.37,20.32 59.69,20.32 61,21.63 P11.P$3 P11.P$2
N$20
  Bottom 0.406: R42.1 19.68,80.01 22.23,82.55 22.23,89.6 CN1.2
N$21
  Bottom 0.406: P11.P$1 66,25.4 66.04,25.4 63.5,27.94 36.51,27.94 29.47,34.98 D2.A
N$22
  Bottom 0.406: IC1.3 15.88,32.38 16.51,33.02 20.06,33.02 D1.A 21.01,34.03 22.23,35.24 D2.C
N$23
  Bottom 0.406: R44.1 124.08,72.39 122.56,72.39 120.02,69.85 59.69,69.85 44.45,54.61 33.02,54.61 30.48,52.07 11.43,52.07 10.16,53.34 P6.P$2
N$24
  Bottom 0.406: R12.1 15.88,67.31 16.51,66.67 IC3.11
N$25
  Bottom 0.406: C10.2 135.51,73.79 R24.2
N$26
  Bottom 0.406: R49.2 141.22,72.39 | 141.22,72.39 C5.2 | Q2.3 141.22,72.39
N$27
  Bottom 0.406: P3.P$3 7.66,85.37 8.57,84.45 8.57,70.48 6.67,68.58 6.67,65.34 R43.1
N$28
  Bottom 0.406: R23.2 C10.1 137.54,73.45 Q2.2
N$29
  Bottom 0.406: R41.2 12.64,76.9 11.43,78.74 11.43,82.55 12.7,83.82 12.7,86.33 P3.P$1
N$30
  Bottom 0.406: P3.P$2 R17.1
N$31
  Bottom 0.406: R18.1 24.77,80.64 27.94,83.82 34.29,83.82 35.56,85.09 P1.P$2
N$32
  Bottom 0.406: R48.2 147.38,69.91 134.37,69.91 133.67,69.22 IC2.8 R5.1
N$33
  Bottom 0.406: IC3.12 15.24,62.17 R13.2 R14.1
N$34  (via drill 0.5)
  Top 0.406: v103.19,26.67 v119.38,26.67
  Bottom 0.406: C8.2 101.28,20.07 101.28,21.59 102.87,23.18 IC4.6 102.87,26.35 v103.19,26.67 | v119.38,26.67 120.65,25.4 P12.P$2 P12.P$1
N$35
  Bottom 0.406: R35.1 29.84,26.29 29.84,22.54 26.04,18.73 13.65,18.73 12.7,19.68 S2.3
N$36
  Bottom 0.406: C5.1 R48.1
N$37
  Bottom 0.406: IC4.13 IC4.14
N$39
  Bottom 0.406: J1.1 103.01,62.23 C23.-
N$41
  Bottom 0.406: R52.1 116.89,24.13 P12.P$3
N$42
  Bottom 0.406: IC2.2 140.02,59.63 R31.2
N$43  (via drill 0.5)
  Top 0.406: v114.94,76.2 114.94,55.24 118.11,52.07 146.05,52.07 147.32,53.34 P9.P$2
  Bottom 0.406: R36.2 148.59,57.78 147.32,56.52 P9.P$2 | v114.94,76.2 114.94,80.96 113.62,82.28 CN2.2 110.81,82.91 R54.2
N$44
  Bottom 0.406: R46.1 R45.2 101.35,26.42 102.87,27.94 IC4.9
N$45
  Bottom 0.813: J4.2 139.38,34.29 142.88,30.8 146.28,30.8 J7.P$4
N$46  (via drill 0.5)
  Top 0.406: P8.P$2 121.92,59.69 v122.56,60.33
  Bottom 0.406: R22.1 126.05,63.56 126.05,61.28 125.09,60.33 v122.56,60.33
N$47
  Bottom 0.406: IC4.10 104.14,31.5 R47.1
N$48
  Bottom 0.406: R3.1 C3.1
N$50
  Bottom 0.406: 138.11,68.52 R4.1 | R4.1 138.43,68.58 139.06,69.22 141.22,69.22 R3.2 | IC2.11 137.48,67.88 R4.1
N$51  (via drill 0.5)
  Top 0.406: P5.P$3 144.82,85.13 134.94,75.25 v134.94,68.58
  Bottom 0.406: IC2.10 136.21,68.52 | 136.21,68.52 R4.2 | 136.21,68.52 135,68.52 v134.94,68.58
N$52
  Bottom 0.406: Q1.2 149.59,71.77 R1.1 150.43,70.8 149.86,70.8 147.64,68.58 C3.2
N$53
  Bottom 0.406: P4.P$2 116.84,83.82 117.79,82.87 C20.2
N$54
  Bottom 0.406: C21.1 146.05,57.78 144.78,56.52 144.78,54.66 P9.P$3
N$55
  Bottom 0.406: C19.2 146.37,82.87 147.32,83.82 P5.P$2
N$57
  Bottom 0.406: C13.2 131.51,72.71 C14.1 129.29,72.45 128.27,71.44 127.95,71.44 127.32,70.8 127.32,70.23 R25.1 127.25,68.59 Q3.2
N$58
  Bottom 0.406: D1.C 28.57,33.97 37.15,25.4 39.37,25.4 40.6,24.17 P10.P$1
N$59
  Bottom 0.406: S7.2 30.48,49.53 33.02,52.07 45.74,52.07 P7.P$3
N$60  (via drill 0.5)
  Top 0.406: v119.38,71.12 v130.81,71.12 130.81,61.28 v132.72,59.37
  Bottom 0.406: 133.72,73.78 R24.1 | R24.1 133.35,73.91 133.35,74.61 133.03,74.93 131.83,74.93 C13.1 131.51,75.25 R29.2 | 133.67,73.72 R24.1 | IC2.5 136.21,60.01 135.57,59.37 v132.72,59.37 | v119.38,71.12 49.21,71.12 33.97,55.88 31.75,55.88 30.48,57.15 S4.2 | v130.81,71.12 131.44,71.12 133.6,73.28 R24.1
N$61
  Bottom 0.406: R40.1 148.34,24.62 D6.A
N$64
  Bottom 0.406: R28.2 124.46,66.04 | 124.46,66.04 C12.2 | 124.46,66.04 124.62,66.52 Q3.1 126.05,67.9 126.05,69.53 124.84,70.74 R44.2
N$65  (via drill 0.5)
  Top 0.406: v120.65,72.39 127,72.39 v135.89,81.28
  Bottom 0.406: v120.65,72.39 47.62,72.39 S4.3 | v135.89,81.28 135.89,78.99 C15.1
N$66
  Bottom 0.406: IC6.5 111.82,66.67 109.86,66.67 109.22,66.04 C22.2 108.99,65.9 C23.+
N$67
  Bottom 0.406: P8.P$3 119.42,52.11 117.16,49.85 110.81,49.85 106.68,45.72 102.87,45.72 101.6,46.99 S8.2
N$68  (via drill 0.5)
  Top 0.406: v22.86,38.1 22.86,36.83 26.67,33.02 v26.67,30.48
  Bottom 0.406: R34.1 C17.2 24.13,31.43 25.4,30.16 Q5.3 | Q5.3 25.48,29.27 R35.2 32.7,25.15 32.7,22.23 41.55,13.38 43.18,13.38 | S3.3 43.18,13.38 | 43.14,13.34 43.18,13.38 | CN3.2 21.9,39.06 v22.86,38.1 | v26.67,30.48 26.52,30.48 Q5.3
N$69
  Bottom 0.406: C11.2 R7.1 127.32,61.82 127.32,62.71 127.64,63.02 129.06,63.02 129.29,63.25 R22.2
N$70
  Bottom 0.406: Q2.1 133.03,71.44 130.81,69.22 130.81,63.28 R7.2 129.54,61.98 R6.1
N$71
  Bottom 0.406: IC3.3 IC3.4
N$72
  Bottom 0.406: R37.2 C28.2 136.21,19.37 IC5.3
N$73  (via drill 0.5)
  Top 0.406: v134.94,15.24 134.94,14.29 136.21,13.02 v136.21,12.06
  Bottom 0.406: IC5.6 v136.21,12.06 | v134.94,15.24 IC5.2 134.94,17.78 134.3,18.41 132.72,18.41 132.08,19.05 132.08,20.95 133.03,21.91 133.6,21.91 R37.1 133.35,23.02 133.67,23.34 133.67,24.07 C26.2
N$74
  Bottom 0.406: 139.38,58.48 R30.1 139.06,58.48 139.06,59.37 138.75,59.69 IC2.3
N$75
  Bottom 0.406: C27.2 136.37,7.78 137.48,8.89 IC5.5
N$76
  Bottom 0.406: D5.A D4.C 137.6,21.97 C28.1
N$77
  Bottom 0.406: C24.2 17.42,25.46 IC1.5
N$78
  Bottom 0.406: R39.2 C22.1
N$79  (via drill 0.5)
  Top 0.813: v146.37,40.32 v152.38,40.32
  Bottom 0.813: J7.VIN0 152.4,42.23 | 152.1,41.91 J7.VIN0 | S1.3 151.13,22.23 151.13,27.3 149.22,29.21 149.22,32.38 148.91,32.7 143.19,32.7 141.92,33.97 141.92,35.88 140.97,36.83 | v152.38,40.32 J7.VIN0 | 140.97,36.83 J4.1 | 140.97,36.83 144.46,40.32 v146.37,40.32 146.37,42.23
NOISE  (via drill 0.5)
  Top 0.406: v133.67,76.52 133.67,64.14 v134.94,62.87
  Bottom 0.406: R26.2 R27.2 127.25,76.2 | 127.25,76.2 R29.1 C14.2 | 127.25,76.2 127.57,76.52 130.81,76.52 133.03,78.74 C15.2 133.67,78.68 v133.67,76.52 | IC2.6 v134.94,62.87
SQ
  Bottom 0.406: R9.2 R8.1 | R9.2 25.4,71.12 | S9.1 93.98,77.47 91.44,74.93 27.94,74.93 24.77,71.75 24.77,71.18 R9.2
TRI
  Bottom 0.406: R14.2 18.41,60.64 19.05,61.28 IC3.9 19.05,66.36 19.68,66.99 24.13,66.99 24.77,66.42 C6.1 | 25.15,65.41 C6.1 | C6.1 26.67,67.56 26.67,71.12 29.21,73.66 95.25,73.66 99.06,77.47 S9.3
V/2
  Bottom 0.406: 106.68,26.04 104.78,26.04 104.14,25.4 IC4.5 104.14,21.97 R21.2 R50.2 103.5,18.99 103.5,17.21 R51.1 C9.2 | 106.68,26.04 107.31,26.04 107.95,25.4 IC4.2 | 106.68,26.04 IC4.12 106.68,31.5 R47.2
WAVE
  Top 0.406: P4.P$3 100.34,86.38 96.52,82.55 S9.2
WAVEFORM
  Bottom 0.406: R26.1 C20.1

### Text on the board
tPlace: Envelope / modulation | LFO / modulation | Oscillator | Noise | Level | Level | Frequency | LFO | Waveshape | Tri | Sq | Tri | Sq | Low | High | Zero | Max | Zero | Max | Zero | Max | Zero | Max | Sound Lab | Resonance | Filter | Amplifier | Frequency | Modulation | Modulation | Level | Off | On | Source | Source | Env. | LFO | Env. | LFO | Low | High | Zero | Max | Zero | Max | Zero | Max | Tri | Sq | Tri | Sq | Envelope Generator | LFO | Power | Attack | Decay | Gate | Frequency | Sustain | Off | Off | On | Repeat | On | Off | On | Short | Long | Short | Long | Low | High
bPlace: Control | Audio Out | Speaker | Power amplifier | VCO | Noise/VCF | 9V Power | Drum | + | Battery | - | Envelope Generator | LFO | 18V | Technoblogy